# Altium schematic sheet Interface.SchDoc
size A3; SheetNumber: 5; SheetTotal: 5
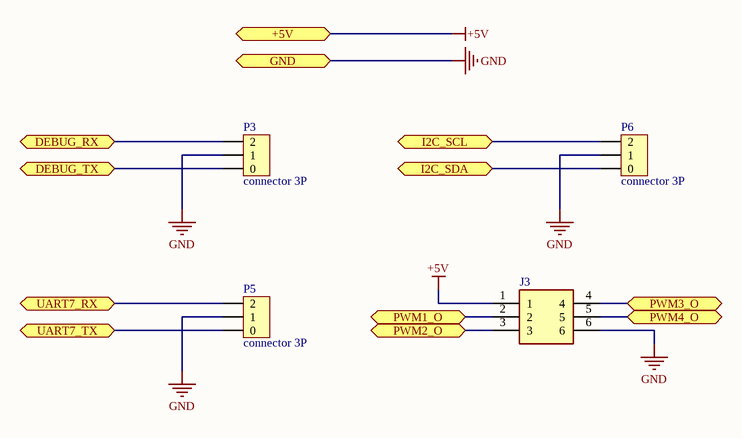
[diagram p0: Interface.SchDoc]

## Parts
J3  SM06B-SRSS-TB__LF__SN_  [SM06B-SRSS-TB]  (value not drawn)
P3  connector 3P  [GH-3AB]
P5  connector 3P  [GH-3AB]
P6  connector 3P  [GH-3AB]

## Ports
+5V (bidir), DEBUG_RX (bidir), DEBUG_TX (bidir), GND (bidir), I2C_SCL (bidir), I2C_SDA (bidir), PWM1_O (bidir), PWM2_O (bidir), PWM3_O (bidir), PWM4_O (bidir), UART7_RX (bidir), UART7_TX (bidir)

## Nets
+5V: J3.1 ; port +5V
GND: J3.6 P3.1 P5.1 P6.1 ; port GND
DEBUG_RX: P3.2 ; port DEBUG_RX
DEBUG_TX: P3.0 ; port DEBUG_TX
I2C_SCL: P6.2 ; port I2C_SCL
I2C_SDA: P6.0 ; port I2C_SDA
PWM1_O: J3.2 ; port PWM1_O
PWM2_O: J3.3 ; port PWM2_O
PWM3_O: J3.4 ; port PWM3_O
PWM4_O: J3.5 ; port PWM4_O
UART7_RX: P5.2 ; port UART7_RX
UART7_TX: P5.0 ; port UART7_TX

## Library data of the parts
J3 = SM06B-SRSS-TB__LF__SN_: Connector; Manufacturer_Name: JST (JAPAN SOLDERLESS TERMINALS); Manufacturer_Part_Number: SM06B-SRSS-TB (LF)(SN); Datasheet Link: http://uk.rs-online.com/web/p/products/5468827